# EAGLE design lm386 (EAGLE 9.2.1)
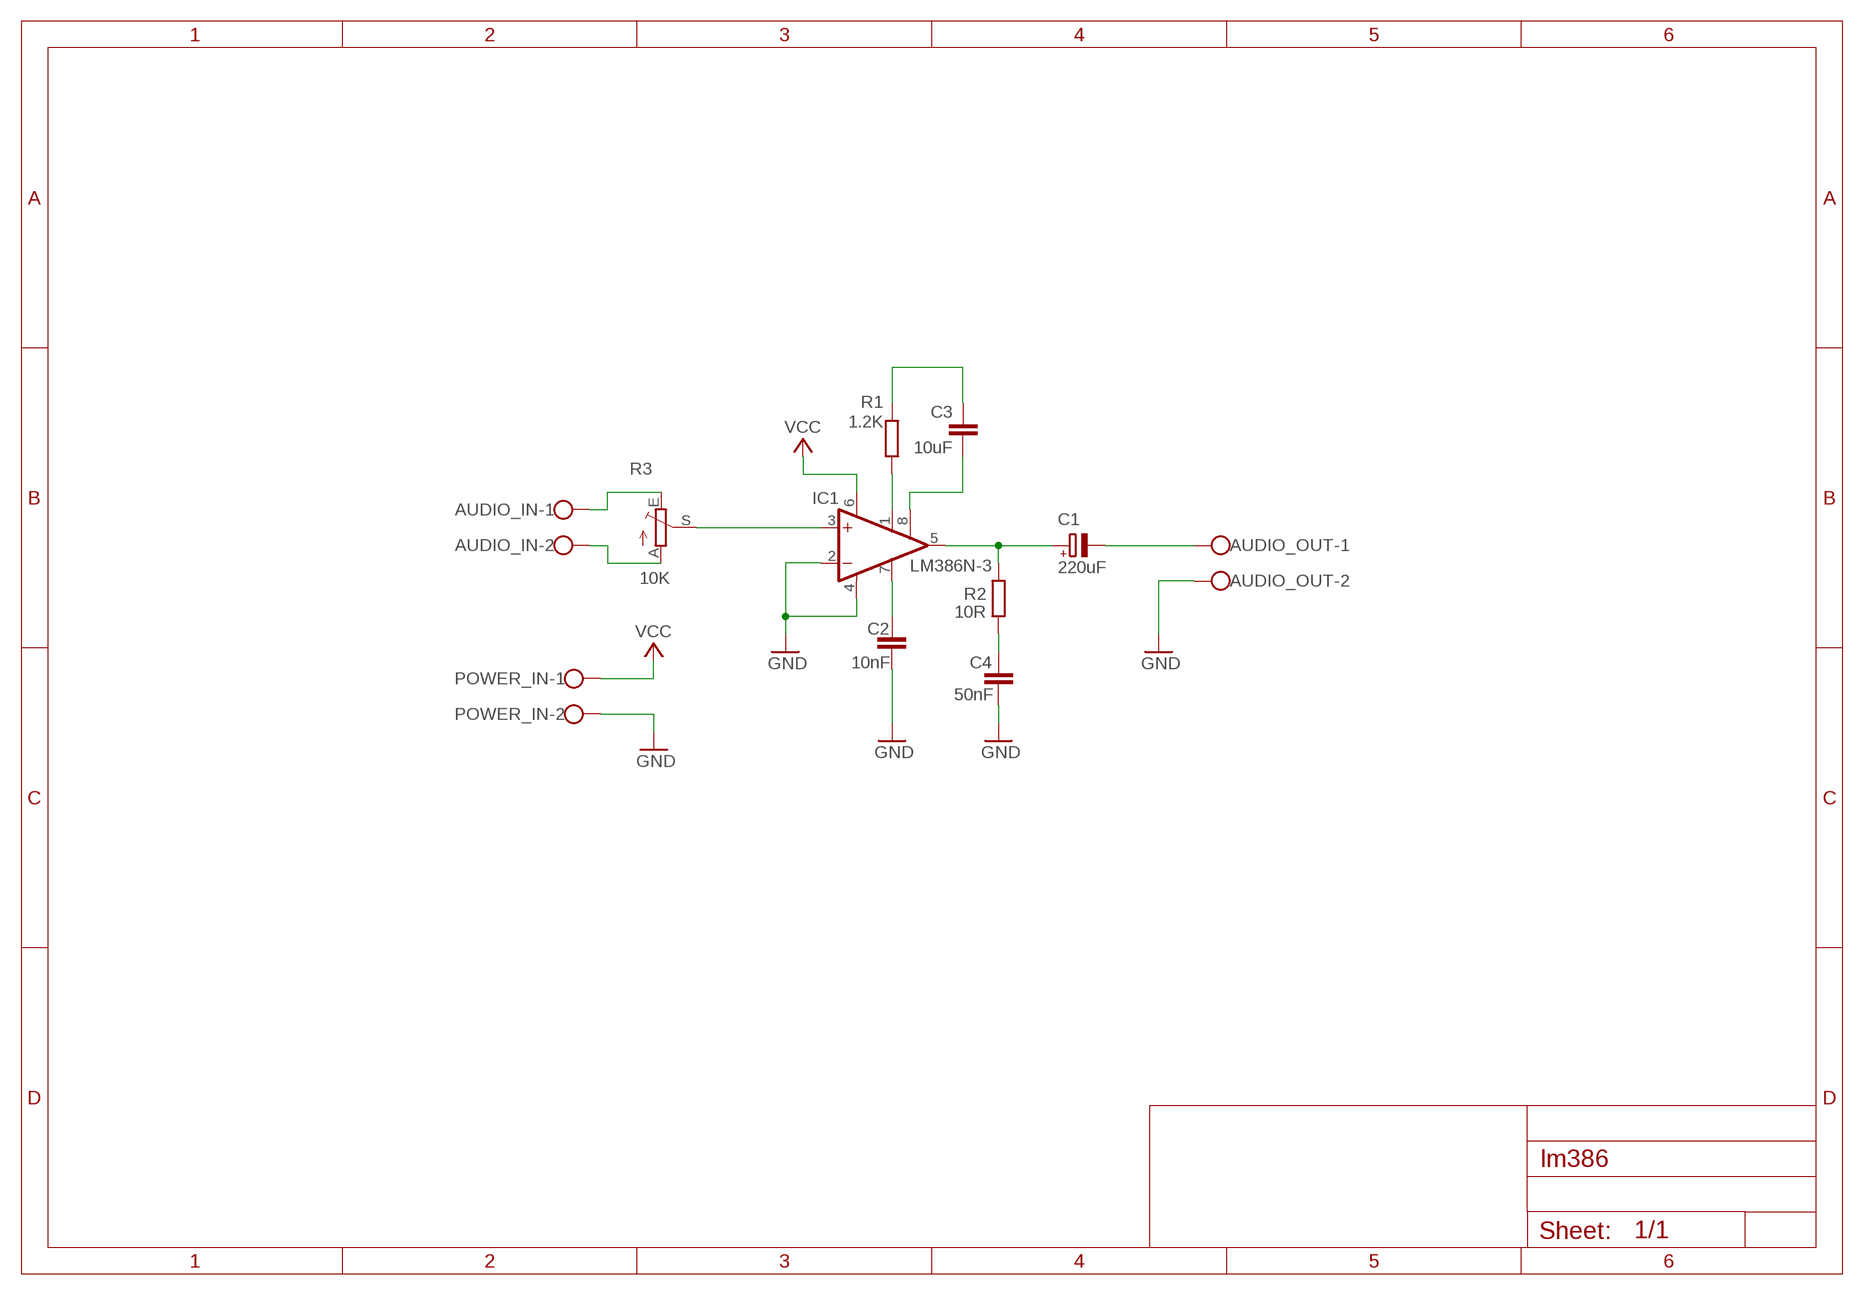
[diagram p0: schematic, sheet 1]

## Parts
AUDIO_IN  W237-102  [W237-102]
AUDIO_OUT  W237-102  [W237-102]
C1  220uF  CPOL-EUE3.5-8  [E3,5-8]
C2  10nF  C-EU025-025X050  [C025-025X050]
C3  10uF  C-EU075-032X103  [C075-032X103]
C4  50nF  C-EU025-025X050  [C025-025X050]
IC1  LM386N-3  [DIL08]
POWER_IN  W237-102  [W237-102]
R1  1.2K  R-EU_0204/7  [0204/7]
R2  10R  R-EU_0204/7  [0204/7]
R3  10K  TRIM_EU-B64Y  [B64Y]

## Nets
GND: AUDIO_OUT.2 C2.1 C4.2 IC1.2(-IN) IC1.4(GND) POWER_IN.2
N$1: AUDIO_IN.1 R3.E
N$2: AUDIO_IN.2 R3.A
N$3: IC1.3(+IN) R3.S
N$4: C2.2 IC1.7(BYPASS)
N$5: C1.+ IC1.5(OUT) R2.2
N$6: C4.1 R2.1
N$7: AUDIO_OUT.1 C1.-
N$8: C3.1 IC1.8(GAIN)
N$9: C3.2 R1.2
N$10: IC1.1(GAIN) R1.1
VCC: IC1.6(VS) POWER_IN.1

## Library data of the parts
AUDIO_IN AUDIO_OUT POWER_IN = con-wago-500:W237-102: WAGO SCREW CLAMP; MPN: 237-102; OC_FARNELL: unknown; OC_NEWARK: 70K9898
C1 = rcl:CPOL-EU: POLARIZED CAPACITOR, European symbol; SPICEPREFIX: C
C2-C4 = rcl:C-EU: CAPACITOR, European symbol; SPICEPREFIX: C
IC1 = linear:LM386?-*: Low Voltage Audio Power Amplifier Source: http://cache.national.com/ds/LM/LM386.pdf
R1 R2 = rcl:R-EU_: RESISTOR, European symbol; SPICEPREFIX: R
R3 = pot:TRIM_EU-: POTENTIOMETER

## Board
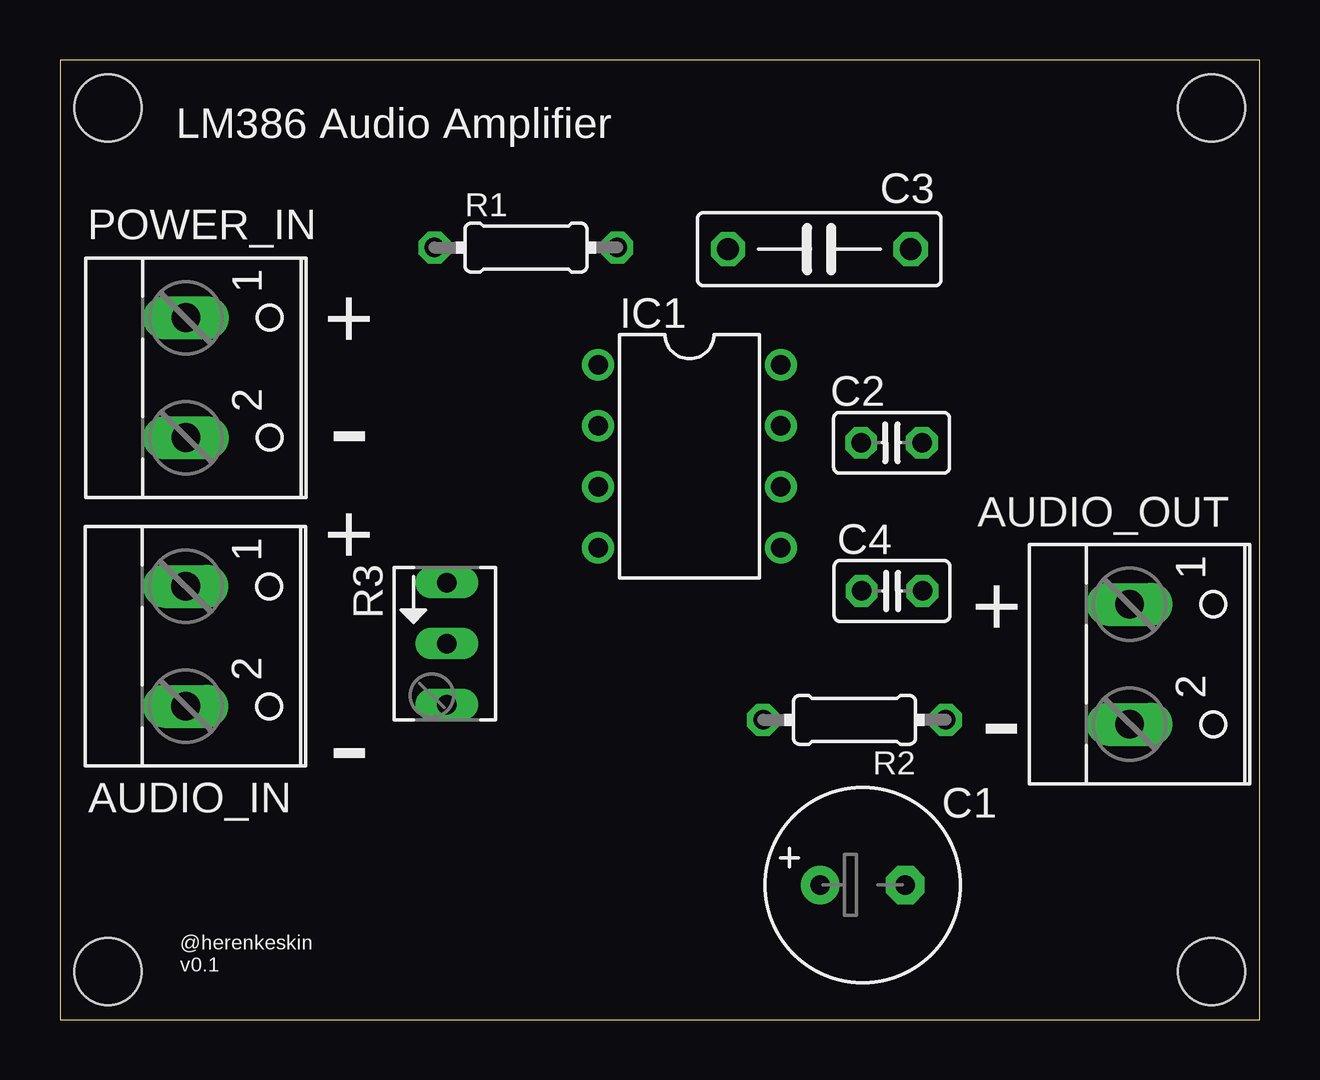
[diagram p1: board, top side]
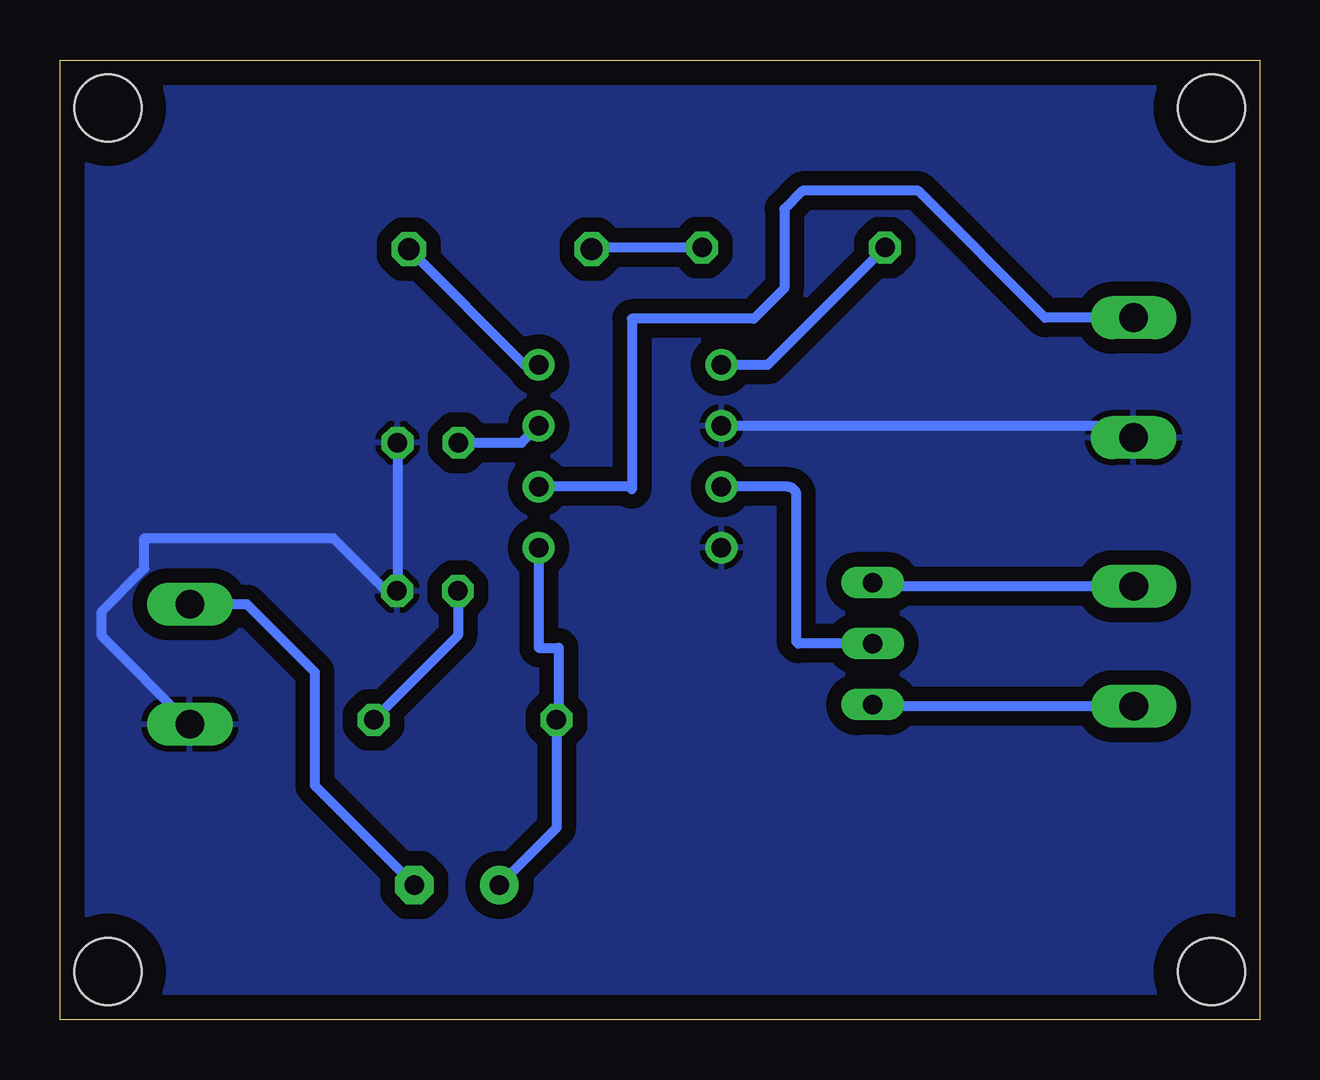
[diagram p2: board, bottom side, seen from below]

Size 50 x 40 mm. Coordinates in mm from the lower left corner, seen from the top.
Outline: 0,0 50,0 50,40 0,40 0,0
Copper layers (1*16): Top 0.035mm / dielectric 1.5mm / Bottom 0.035mm
Design rules "default": minimum track width 6mil, minimum drill 0.35mm, track to track 6mil, track to pad 6mil, pad to pad 6mil, via to via 6mil, smd to smd 6mil, copper to edge 40mil, drill to drill 6mil, minimum pad ring 10mil, minimum via ring 8mil, stop-mask expansion 4mil, vias tented up to drill 0mil, thermal gap 10mil
Holes 2.8 mm at 2,38 48,38 48,2 2,2

### Footprints (pad centres in the part's own frame; a part is rotated, then mirrored left to right if it is on the bottom)
W237-102 = drill 1.194 long: 1 -2.5,-1.27; 2 2.5,-1.27
E3,5-8 = drill 0.813 pad 1.6: + -1.778,0 | drill 0.813 pad 1.6 octagon: - 1.778,0
C025-025X050 = drill 0.813 octagon: 1 -1.27,0; 2 1.27,0
C075-032X103 = drill 0.914 octagon: 1 -3.81,0; 2 3.81,0
DIL08 = drill 0.813 pad 1.27: 1 -3.81,-3.81; 2 -1.27,-3.81; 3 1.27,-3.81; 4 3.81,-3.81; 5 3.81,3.81; 6 1.27,3.81; 7 -1.27,3.81; 8 -3.81,3.81
0204/7 = drill 0.813 octagon: 1 -3.81,0; 2 3.81,0
B64Y = drill 0.813 long: A 2.54,0; E -2.54,0; S 0,0

### Placement (x,y rotation side)
AUDIO_IN  6.51,15.56 270 top
AUDIO_OUT  45.86,14.81 270 top
C1  33.46,5.61 0 top
C2  34.66,24.04 180 top
C3  31.65,32.12 180 top
C4  34.68,17.87 0 top
IC1  26.24,23.48 270 top
POWER_IN  6.53,26.76 270 top
R1  19.42,32.18 0 top
R2  33.12,12.49 180 top
R3  16.13,15.67 270 top

### Tracks (layer width: path | path; a pad name or v marks a point on that pad's centre or on a via)
GND
  Bottom 0.406: POWER_IN.2 arc-90 5.75,24.75 IC1.2 | C2.1 35.93,17.89 C4.2 36.41,17.87 38.61,20.07 46.48,20.07 46.48,18.8 48.26,17.02 48.26,15.98 AUDIO_OUT.2
  pour Bottom (isolate 0.61): 0,40 50,40 50,0 0,0
N$1
  Bottom 0.406: AUDIO_IN.1 15.98,18.06 R3.E
N$2
  Bottom 0.406: AUDIO_IN.2 16.06,13.06 R3.A
N$3
  Bottom 0.406: R3.S 19.23,15.67 19.3,15.75 19.3,21.84 arc-90 19.67,22.21 IC1.3
N$4
  Bottom 0.406: C2.2 30.76,24.04 IC1.7
N$5
  Bottom 0.406: IC1.5 30.05,15.49 29.21,15.49 29.21,12.49 R2.2 29.31,7.98 C1.+
N$6
  Bottom 0.406: C4.1 33.41,16.01 R2.1
N$7
  Bottom 0.406: C1.- 39.37,9.74 39.37,14.48 42.2,17.31 AUDIO_OUT.1
N$8
  Bottom 0.406: C3.1 30.63,27.29 IC1.8
N$9
  Bottom 0.406: R1.2 27.78,32.18 C3.2
N$10
  Bottom 0.406: R1.1 20.5,27.29 IC1.1
VCC
  Bottom 0.406: IC1.6 26.27,22.21 26.16,22.1 26.16,29.21 21.08,29.21 19.81,30.48 19.81,33.78 19.05,34.54 14.22,34.54 8.94,29.26 POWER_IN.1

### Text on the board
tNames: LM386 Audio Amplifier | + | - | + | + | - | - | @herenkeskin / v0.1